# EAGLE design RN4020_Breakout (EAGLE 7.5.0)
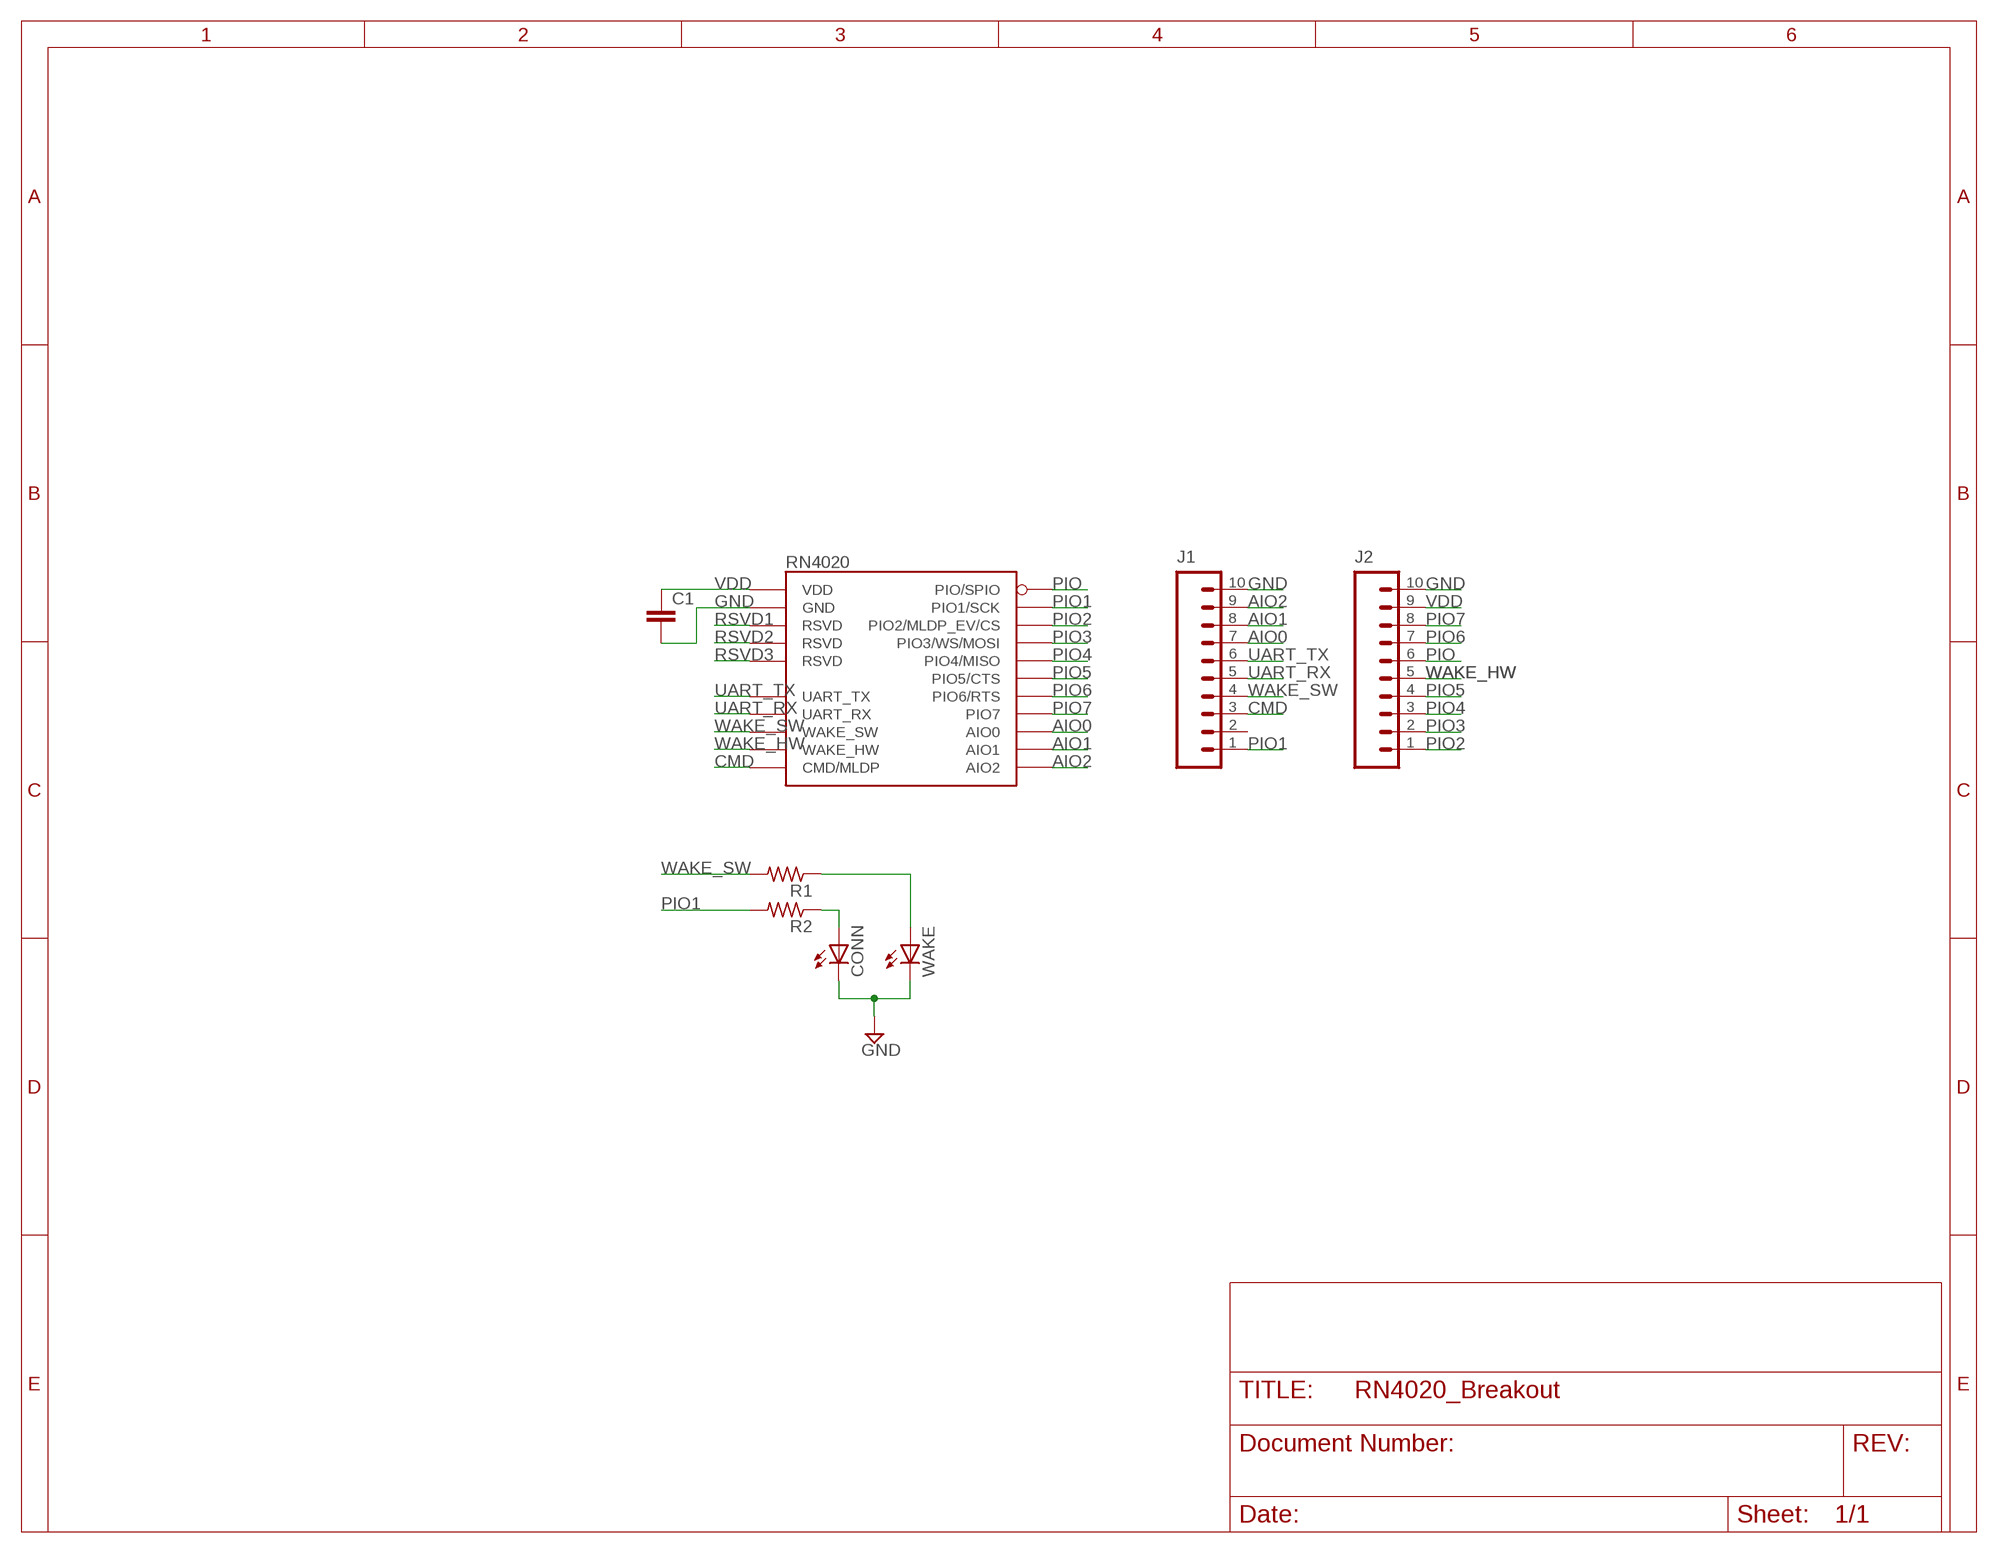
[diagram p0: schematic, sheet 1]

## Parts
C1  C-EUC0805  [C0805]
CONN  LEDCHIPLED_0805  [CHIPLED_0805]
J1  M10LOCK  [1X10_LOCK]
J2  M10LOCK  [1X10_LOCK]
R1  R-US_R0805  [R0805]
R2  R-US_R0805  [R0805]
RN4020  RN4020  [RN4020]
WAKE  LEDCHIPLED_0805  [CHIPLED_0805]

## Nets
AIO0: J1.7 RN4020.P$4(AIO0)
AIO1: J1.8 RN4020.P$3(AIO1)
AIO2: J1.9 RN4020.P$2(AIO2)
CMD: J1.3 RN4020.P$8(CMD/MLDP)
GND: C1.2 CONN.C J1.10 J2.10 RN4020.P$1(GND) RN4020.P$9(GND) RN4020.P$16(GND) RN4020.P$24(GND) WAKE.C
N$2: R1.1 WAKE.A
N$3: CONN.A R2.1
PIO: J2.6 RN4020.P$17(PIO/SPIO)
PIO1: J1.1 R2.2 RN4020.P$10(PIO1/SCK)
PIO2: J2.1 RN4020.P$11(PIO2/MLDP_EV/CS)
PIO3: J2.2 RN4020.P$12(PIO3/WS/MOSI)
PIO4: J2.3 RN4020.P$13(PIO4/MISO)
PIO5: J2.4 RN4020.P$14(PIO5/CTS)
PIO6: J2.7 RN4020.P$18(PIO6/RTS)
PIO7: J2.8 RN4020.P$19(PIO7)
RSVD1: RN4020.P$20(RSVD)
RSVD2: RN4020.P$21(RSVD)
RSVD3: RN4020.P$22(RSVD)
UART_RX: J1.5 RN4020.P$6(UART_RX)
UART_TX: J1.6 RN4020.P$5(UART_TX)
VDD: C1.1 J2.9 RN4020.P$23(VDD)
WAKE_HW: J2.5 RN4020.P$15(WAKE_HW)
WAKE_SW: J1.4 R1.2 RN4020.P$7(WAKE_SW)
Unconnected: J1.2

## Library data of the parts
C1 = rcl:C-EU: CAPACITOR, European symbol
CONN WAKE = led:LED: LED OSRAM: - CHIPLED LG R971, LG N971, LY N971, LG Q971, LY Q971, LO R971, LY R971 LH N974, LH R974 LS Q976, LO Q976, LY Q976 LO Q996 - Hyper CHIPLED LW Q18S LB Q993, LB Q99A, LB R99A - SideLED LS A670, LO A670, LY A670, LG A670, LP A670 LB A673, LV A673, LT A673, LW A673 LH A674 LY A675 LS A676, LA A676, LO A676, LY A676, LW A676 LS A679, LY A679, LG A679 - Hyper Micro SIDELED® LS Y876, LA Y876, LO Y876, LY Y876 LT Y87S - SmartLED LW L88C, LW L88S LB L89C, LB L89S, LG L890 LS L89K, LO L89K, LY L89K LS L896, LA L896, LO L896, LY L896 - TOPLED LS T670, LO T670, LY T670, LG T670, LP T670 LSG T670, LSP T670, LSY T670, LOP T670, LYG T670 LG T671, LOG T671, LSG T671 LB T673, LV T673, LT T673, LW T673 LH T674 LS T676, LA T676, LO T676, LY T676, LB T676, LH T676, LSB T676, LW T676 LB T67C, LV T67C, LT T67C, LS T67K, LO T67K, LY T67K, LW E67C LS E67B, LA E67B, LO E67B, LY E67B, LB E67C, LV E67C, LT E67C LW T67C LS T679, LY T679, LG T679 LS T770, LO T770, LY T770, LG T770, LP T770 LB T773, LV T773, LT T773, LW T773 LH T774 LS E675, LA E675, LY E675, LS T675 LS T776, LA T776, LO T776, LY T776, LB T776 LHGB T686 LT T68C, LB T68C - Hyper Mini TOPLED® LB M676 - Mini TOPLED Santana® LG M470 LS M47K, LO M47K, LY M47K Source: http://www.osram.convergy.de LUXEON: - LUMILED® LXK2-PW12-R00, LXK2-PW12-S00, LXK2-PW14-U00, LXK2-PW14-V00 LXK2-PM12-R00, LXK2-PM12-S00, LXK2-PM14-U00 LXK2-PE12-Q00, LXK2-PE12-R00, LXK2-PE12-S00, LXK2-PE14-T00, LXK2-PE14-U00 LXK2-PB12-K00, LXK2-PB12-L00, LXK2-PB12-M00, LXK2-PB14-N00, LXK2-PB14-P00, LXK2-PB14-Q00 LXK2-PR12-L00, LXK2-PR12-M00, LXK2-PR14-Q00, LXK2-PR14-R00 LXK2-PD12-Q00, LXK2-PD12-R00, LXK2-PD12-S00 LXK2-PH12-R00, LXK2-PH12-S00 LXK2-PL12-P00, LXK2-PL12-Q00, LXK2-PL12-R00 Source: www.luxeon.com KINGBRIGHT: KA-3528ASYC Source: www.kingbright.com
J1 J2 = SparkFun-Connectors:M10: Header 10 Standard 10-pin 0.1" header. Use with straight break away headers (SKU : PRT-00116), right angle break away headers (PRT-00553), swiss pins (PRT-00743), machine pins (PRT-00117), and female headers (PRT-00115).
R1 R2 = rcl:R-US_: RESISTOR, American symbol
RN4020 = HadleyResearch:RN4020

## Board
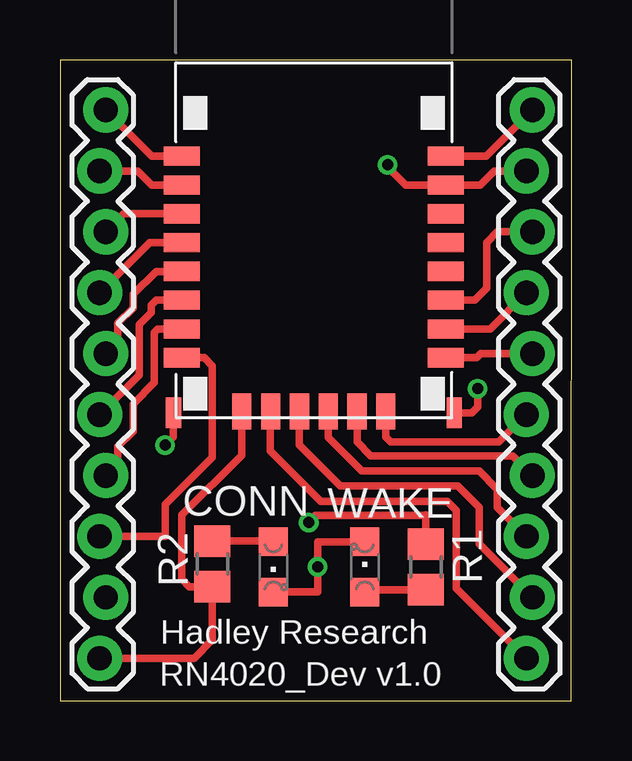
[diagram p1: board, top side]
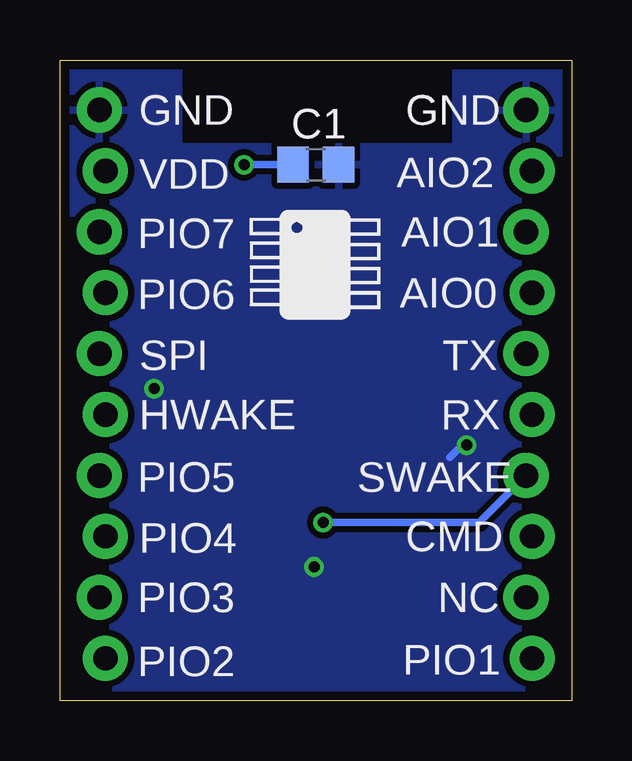
[diagram p2: board, bottom side, seen from below]

Size 21.32 x 26.72 mm. Coordinates in mm from the lower left corner, seen from the top.
Outline: 0,0 21.31,0 21.32,26.72 0,26.72 0,0
Copper layers (1*16): Top 0.0356mm / dielectric 1.5011mm / Bottom 0.0356mm
Design rules "HadleyResearch": minimum track width 8mil, minimum drill 13mil, track to track 8mil, track to pad 8mil, pad to pad 6mil, via to via 8mil, smd to smd 6mil, copper to edge 15mil, drill to drill 8mil, minimum pad ring 7mil, minimum via ring 7mil, stop-mask expansion 3mil, vias tented up to drill 20mil, thermal gap 10mil

### Footprints (pad centres in the part's own frame; a part is rotated, then mirrored left to right if it is on the bottom)
C0805 = smd 1.3 x 1.5: 1 -0.95,0; 2 0.95,0
CHIPLED_0805 = smd 1.2 x 1.2: A 0,-1.05; C 0,1.05
1X10_LOCK = drill 1.016 pad 1.88: 1 0,0.127; 2 2.54,-0.127; 3 5.08,0.127; 4 7.62,-0.127; 5 10.16,0.127; 6 12.7,-0.127; 7 15.24,0.127; 8 17.78,-0.127; 9 20.32,0.127; 10 22.86,-0.127
R0805 = smd 1.3 x 1.5: 1 -0.95,0; 2 0.95,0
RN4020 = smd 1.5 x 0.8: P$1 0.25,10.9; P$2 0.25,9.7; P$3 0.25,8.5; P$4 0.25,7.3; P$5 0.25,6.1; P$6 0.25,4.9; P$7 0.25,3.7; P$8 0.25,2.5; P$17 11.25,2.5; P$18 11.25,3.7; P$19 11.25,4.9; P$20 11.25,6.1; P$21 11.25,7.3; P$22 11.25,8.5; P$23 11.25,9.7; P$24 11.25,10.9 | smd 0.635 x 1.27: P$9 -0.1,0.2; P$16 11.6,0.2 | smd 0.8 x 1.5: P$10 2.75,0.25; P$11 3.95,0.25; P$12 5.15,0.25; P$13 6.35,0.25; P$14 7.55,0.25; P$15 8.75,0.25

### Placement (x,y rotation side)
C1  10.67,22.35 0 bottom
CONN  8.89,5.59 180 top
J1  1.78,1.78 90 top
J2  19.56,1.78 90 top
R1  15.24,5.59 90 top
R2  6.35,5.72 270 top
RN4020  4.83,11.81 0 top
WAKE  12.7,5.59 0 top

### Tracks (layer width: path | path; a pad name or v marks a point on that pad's centre or on a via)
AIO0
  Top 0.305: RN4020.P$4 3.74,19.11 J1.7
AIO1
  Top 0.305: RN4020.P$3 2.66,20.31 J1.8
AIO2
  Top 0.305: RN4020.P$2 3.83,21.51 3.24,22.1 J1.9
CMD
  Top 0.305: RN4020.P$8 6.01,14.31 6.35,13.97 6.35,10.16 4.38,8.19 4.38,6.86 J1.3
GND  (via drill 0.46)
  Top 0.305: RN4020.P$1 3.83,22.71 J1.10 | RN4020.P$24 17.76,22.71 J2.10 | CONN.C 10.73,4.54 v10.73,5.59 10.73,6.64 WAKE.C | RN4020.P$9 4.73,11.01 v4.38,10.67 | RN4020.P$16 17.15,12.01 17.4,12.26 v17.4,13.02
  Bottom 0.305: v4.38,10.67 4.57,10.67 5.08,10.16
  pour Bottom (isolate 0.254): 0,26.67 4.83,26.67 4.83,23.11 16.38,23.11 16.38,26.67 21.34,26.67 21.34,0 0,0
N$2
  Top 0.305: R1.1 12.8,4.64 WAKE.A
N$3
  Top 0.305: R2.1 8.86,6.67 CONN.A
PIO
  Top 0.305: RN4020.P$17 17.36,14.31 17.53,14.48 J2.6
PIO1
  Top 0.305: J1.1 5.59,1.78 6.35,2.54 R2.2 5.39,4.77 5.08,5.08 5.08,7.75 7.58,10.24 RN4020.P$10
PIO2
  Top 0.305: J2.1 16.51,4.7 16.51,7.94 16.13,8.32 10.86,8.32 8.76,10.41 8.76,12.05 RN4020.P$11
PIO3
  Top 0.305: RN4020.P$12 9.98,10.66 11.68,8.95 16.57,8.95 17.46,8.06 17.46,6.54 J2.2
PIO4
  Top 0.305: RN4020.P$13 11.18,10.99 12.57,9.59 17.46,9.59 18.22,8.83 18.22,8.06 J2.3
PIO5
  Top 0.305: RN4020.P$14 12.38,10.8 12.95,10.22 18.86,10.22 J2.4
PIO6
  Top 0.305: RN4020.P$18 17.92,15.51 J2.7
PIO7
  Top 0.305: RN4020.P$19 17.28,16.71 17.78,17.21 17.78,19.11 18.22,19.56 J2.8
UART_RX
  Top 0.305: RN4020.P$6 4.01,16.71 3.81,16.51 3.81,16.19 3.3,15.68 3.3,13.59 J1.5
UART_TX
  Top 0.305: RN4020.P$5 4,17.91 3.05,16.95 3.05,16.38 2.41,15.75 2.41,14.99 J1.6
VDD  (via drill 0.46)
  Top 0.305: J2.9 18.1,22.1 17.51,21.51 RN4020.P$23 14.4,21.51 13.65,22.26 v13.65,22.35
  Bottom 0.305: v13.65,22.35 C1.1
WAKE_HW
  Top 0.305: RN4020.P$15 13.58,11 13.78,10.8 18.29,10.8 J2.5
WAKE_SW  (via drill 0.46)
  Top 0.305: RN4020.P$7 4.08,15.51 3.94,15.37 3.94,13.27 3.05,12.38 3.05,11.24 2.41,10.6 2.41,9.91 J1.4 | R1.2 15.24,7.75 15.24,7.74 10.64,7.74 10.36,7.46 v10.36,7.44
  Bottom 0.305: J1.4 3.86,7.44 v10.36,7.44

### Text on the board
tPlace: Hadley Research | RN4020_Dev v1.0
bPlace: GND | GND | AIO2 | VDD | AIO1 | PIO7 | AIO0 | PIO6 | TX | SPI | RX | HWAKE | SWAKE | PIO5 | CMD | PIO4 | NC | PIO3 | PIO1 | PIO2
200bmp: C:/Users/George Hadley/Documents/Projects/Technology/Prototyping/RN4020_Breakout/Electrical/HR_Icon_small.bmp